# EAGLE design Oled128x32 (EAGLE 9.2.2)
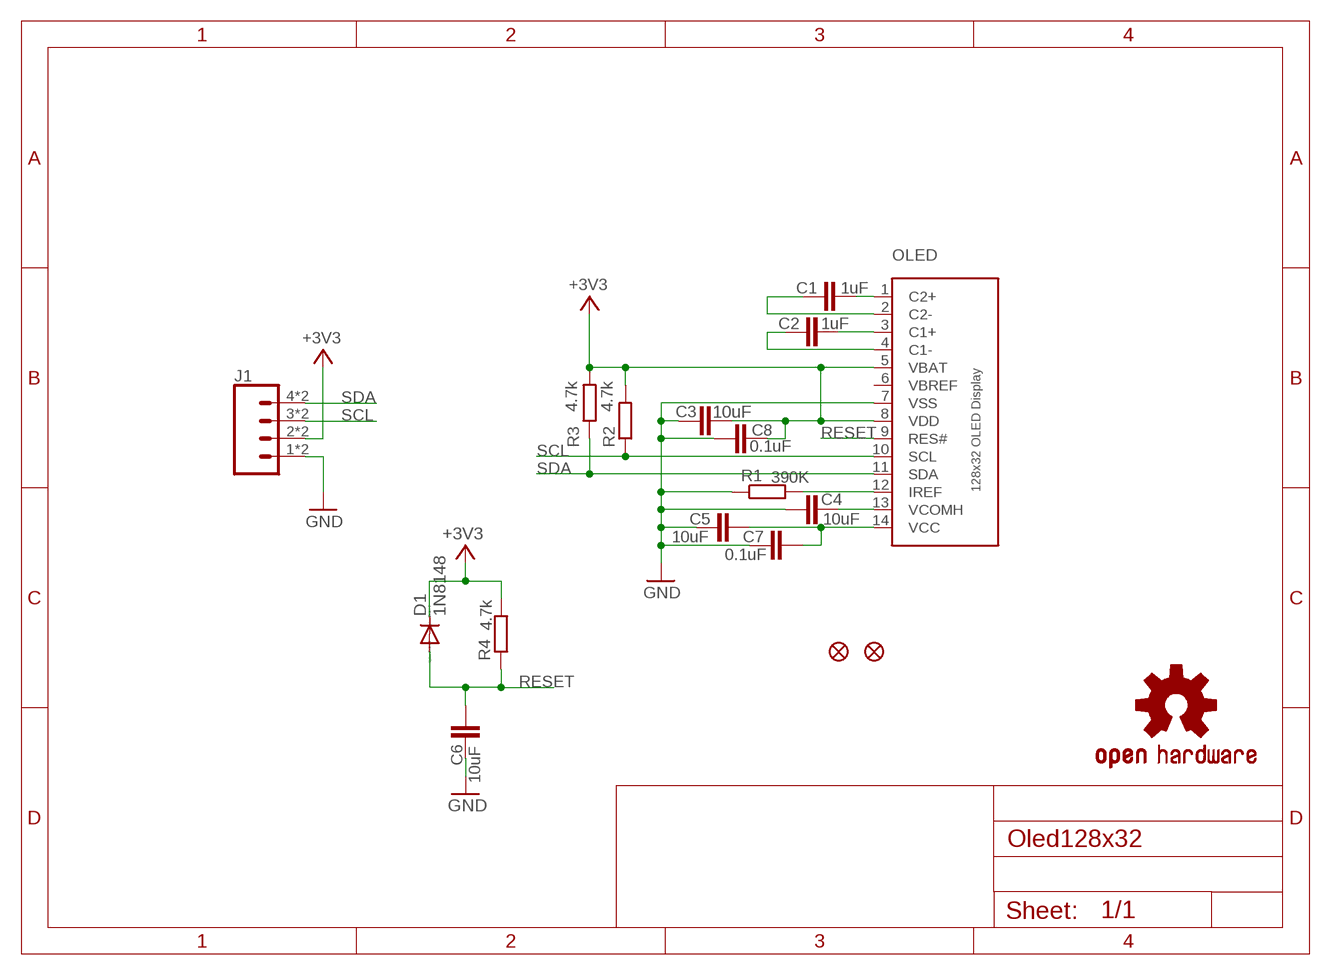
[diagram p0: schematic, sheet 1]

## Parts
C1  1uF  C-EUC0603  [C0603]
C2  1uF  C-EUC0603  [C0603]
C3  10uF  C-EUC0603  [C0603]
C4  10uF  C-EUC0603  [C0603]
C5  10uF  C-EUC0603  [C0603]
C6  10uF  C-EUC0603  [C0603]
C7  0.1uF  C-EUC0603  [C0603]
C8  0.1uF  C-EUC0603  [C0603]
D1  1N8148  DIODE-SOD110-W  [SOD110-W]
FD1  FIDUCIAL1X2  [FIDUCIAL-1X2]
FD2  FIDUCIAL1X2  [FIDUCIAL-1X2]
J1  1X04_SMD_STRAIGHT_COMBO  CONN_04SMD_STRAIGHT_COMBO  [1X04_SMD_VERTICAL_COMBO]
LOGO1  OSHW-LOGOS  [OSHW-LOGO-S]
OLED  OLED_128X32_UG-2832HSWEG02  [OLED_128X32_UG-2832HSWEG02_WRAPUNDER]
R1  390K  R-EU_R0603  [R0603]
R2  4.7k  R-EU_R0603  [R0603]
R3  4.7k  R-EU_R0603  [R0603]
R4  4.7k  R-EU_R0603  [R0603]

## Nets
+3V3: C3.2 C8.2 D1.C J1.2 J1.2-2 OLED.5(VBAT) OLED.8(VDD) R2.2 R3.2 R4.2
GND: C3.1 C4.1 C5.1 C6.1 C7.1 C8.1 J1.1 J1.1-2 OLED.7(VSS) R1.1
N$1: C1.2 OLED.1(C2+)
N$2: C1.1 OLED.2(C2-)
N$3: C2.2 OLED.3(C1+)
N$4: C2.1 OLED.4(C1-)
N$6: C4.2 OLED.13(VCOMH)
N$7: C5.2 C7.2 OLED.14(VCC)
N$8: OLED.12(IREF) R1.2
RESET: C6.2 D1.A OLED.9(RES#) R4.1
SCL: J1.3 J1.3-2 OLED.10(SCL) R2.1
SDA: J1.4 J1.4-2 OLED.11(SDA) R3.1

## Power pins joined to a net without a drawn wire
VBREF: OLED.6(VBREF)

## Library data of the parts
C1-C8 = rcl:C-EU: CAPACITOR, European symbol; SPICEPREFIX: C
D1 = diode:DIODE-: DIODE
FD1 FD2 = SparkFun-Aesthetics:FIDUCIAL: Fiducial Alignment Points Point-of-reference for pick-and-place machines and other optical instruments.
J1 = SparkFun-Connectors:CONN_04: Multi connection point. Often used as Generic Header-pin footprint for 0.1 inch spaced/style header connections On any of the 0.1 inch spaced packages, you can populate with these: Break Away Headers - Straight <https://www.sparkfun.com/products/116> (PRT-00116) Break Away Male Headers - Right Angle <https://www.sparkfun.com/products/553> (PRT-00553) Female Headers <https://www.sparkfun.com/products/115> (PRT-00115) Break Away Headers - Machine Pin <https://www.sparkfun.com/products/117> (PRT-00117) Break Away Female Headers - Swiss Machine Pin <https://www.sparkfun.com/products/743> (PRT-00743) For SCREWTERMINALS and SPRING TERMINALS visit here: Screw Terimnals on SparkFun.com <https://www.sparkfun.com/search/results?term=Screw+Terminals> (5mm/3.5mm/2.54mm spacing) This device is also useful as a general connection point to wire up your design to another part of your project. Our various solder wires solder well into these plated through hole pads. Hook-Up Wire - Assortment (Stranded, 22 AWG) <https://www.sparkfun.com/products/11375> (PRT-11375) Hook-Up Wire - Assortment (Solid Core, 22 AWG) <https://www.sparkfun.com/products/11367> (PRT-11367) View the entire wire category on our website here <https://www.sparkfun.com/categories/141> Special notes: Molex polarized connector foot print use with SKU : PRT-08231 with associated crimp pins and housings. 1MM SMD Version SKU: PRT-10208; PROD_ID: CONN-08511
LOGO1 = SparkFun-Aesthetics:OSHW-LOGO: Open-Source Hardware (OSHW) Logo This logo indicates the piece of hardware it is found on incorporates a OSHW license and/or adheres to the definition of open source hardware found here: http://freedomdefined.org/OSHW
OLED = pmc_lib:OLED_128X32_UG-2832HSWEG02: 128x32 I2C 0.91" Monochrome OLED Display
R1-R4 = rcl:R-EU_: RESISTOR, European symbol; SPICEPREFIX: R

## Board
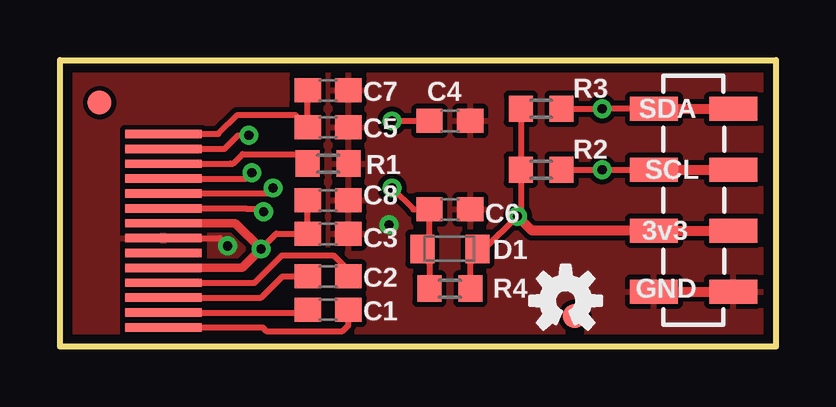
[diagram p1: board, top side]
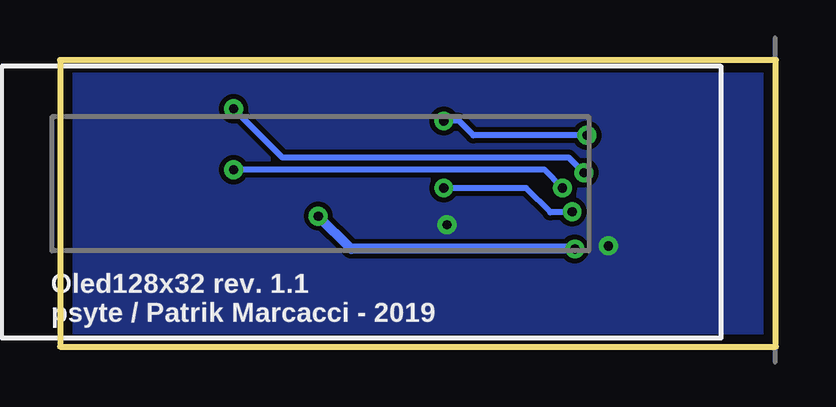
[diagram p2: board, bottom side, seen from below]

Size 29.84 x 11.94 mm. Coordinates in mm from the lower left corner, seen from the top.
Outline: 29.84,0 0,0 0,11.94 29.84,11.94 29.84,0
Copper layers (1*16): Top 0.035mm / dielectric 1.5mm / Bottom 0.035mm
Design rules "default *": minimum track width 6mil, minimum drill 15mil, track to track 8mil, track to pad 8mil, pad to pad 8mil, via to via 8mil, smd to smd 6mil, copper to edge 15mil, drill to drill 6mil, minimum pad ring 8mil, minimum via ring 8mil, stop-mask expansion 2mil, vias tented up to drill 15mil, thermal gap 8mil

### Footprints (pad centres in the part's own frame; a part is rotated, then mirrored left to right if it is on the bottom)
C0603 = smd 1.1 x 1: 1 -0.85,0; 2 0.85,0
SOD110-W = smd 1 x 1.2: A 1.15,0; C -1.15,0
FIDUCIAL-1X2 = smd 1 x 1: 1 0,0
1X04_SMD_VERTICAL_COMBO = smd 1 x 2: 1 0,-1.65; 1-2 0,1.65; 2 2.54,1.65; 2-2 2.54,-1.65; 3 5.08,-1.65; 3-2 5.08,1.65; 4 7.62,1.65; 4-2 7.62,-1.65
OLED_128X32_UG-2832HSWEG02_WRAPUNDER = smd 3.2 x 0.35 bottom: 1 -2.03,-5.3; 2 -2.03,-4.68; 3 -2.03,-4.06; 4 -2.03,-3.44; 5 -2.03,-2.82; 6 -2.03,-2.2; 7 -2.03,-1.58; 8 -2.03,-0.96; 9 -2.03,-0.34; 10 -2.03,0.28; 11 -2.03,0.9; 12 -2.03,1.52; 13 -2.03,2.14; 14 -2.03,2.76
R0603 = smd 1 x 1.1: 1 -0.85,0; 2 0.85,0

### Placement (x,y rotation side)
C1  11.18,1.52 0 top
C2  11.18,2.92 180 top
C3  11.18,4.7 180 top
C4  16.26,9.4 180 top
C5  11.18,9.14 180 top
C6  16.26,5.71 180 top
C7  11.18,10.67 180 top
C8  11.18,6.1 180 top
D1  16.26,4.06 180 top
FD1  1.65,10.16 0 top
FD2  21.46,1.27 0 top
J1  26.42,2.29 90 top
LOGO1  21.08,1.91 0 top
OLED  2.29,6.1 0 bottom
R1  11.18,7.62 180 top
R2  20.07,7.37 180 top
R3  20.07,9.91 180 top
R4  16.26,2.41 0 top

### Tracks (layer width: path | path; a pad name or v marks a point on that pad's centre or on a via)
+3V3  (via drill 0.38)
  Top 0.254: v8.38,4.06 9.02,4.7 C3.2 C8.2 | R4.2 17.11,3.46 D1.C 17.71,4.06 v19.08,5.43 19.22,5.57 R2.2 R3.2
  Top 0.356: OLED.8 7.31,5.14 v8.38,4.06 7.59,3.28 OLED.5
  Top 0.406: J1.2 19.68,4.83 v19.08,5.43
  Bottom 0.406: v8.38,4.06 17.71,4.06 v19.08,5.43
GND  (via drill 0.38)
  Top 0.254: OLED.7 6.66,4.52 v6.99,4.19
  other vias: 13.72,5.08
  pour Bottom: 29.84,11.94 0,11.94 0,0 29.84,0
  pour Top: 29.72,11.94 0,11.94 0,0 29.72,0
N$1
  Top 0.254: C1.2 12.03,0.89 11.78,0.64 8.6,0.64 8.45,0.8 OLED.1
N$2
  Top 0.254: OLED.2 10.22,1.42 C1.1
N$3
  Top 0.254: OLED.3 8.39,2.04 9.27,2.92 C2.2
N$4
  Top 0.254: OLED.4 8.11,2.66 9.25,3.8 11.4,3.8 12.03,3.17 C2.1
N$6  (via drill 0.38)
  Top 0.254: OLED.13 6.86,8.24 7.42,8.8 v7.87,8.8 | v13.84,9.4 C4.2
  Bottom 0.254: v7.87,8.8 12.61,8.8 13.21,9.4 v13.84,9.4
N$7
  Top 0.254: OLED.14 6.6,8.86 7.4,9.65 9.82,9.65 C5.2 C7.2
N$8
  Top 0.254: OLED.12 7.11,7.62 7.21,7.62 7.61,8.01 9.93,8.01 R1.2
RESET  (via drill 0.38)
  Top 0.254: OLED.9 7.75,5.76 7.76,5.74 8.36,5.74 v8.49,5.61 | v13.84,6.6 14.73,5.71 C6.2 15.41,4.36 D1.A 15.11,3.76 15.41,3.46 R4.1
  Bottom 0.254: v8.49,5.61 8.52,5.59 9.4,5.59 10.41,6.6 v13.84,6.6
SCL  (via drill 0.38)
  Top 0.254: v8.89,6.6 8.66,6.38 OLED.10 | R2.1 v22.61,7.37 J1.3-2
  Bottom 0.254: v8.89,6.6 9.65,7.37 v22.61,7.37
SDA  (via drill 0.38)
  Top 0.254: OLED.11 7.76,7 v8,7.24 | R3.1 v22.61,9.91 J1.4
  Bottom 0.254: v8,7.24 8.64,7.87 20.57,7.87 v22.61,9.91

### Text on the board
tPlace: SDA | SCL | 3v3 | GND
bPlace: Oled128x32 rev. 1.1 / psyte / Patrik Marcacci - 2019